# Altium schematic sheet NeoGBP_Design_Schema.schdoc
size 297 x 201 mm
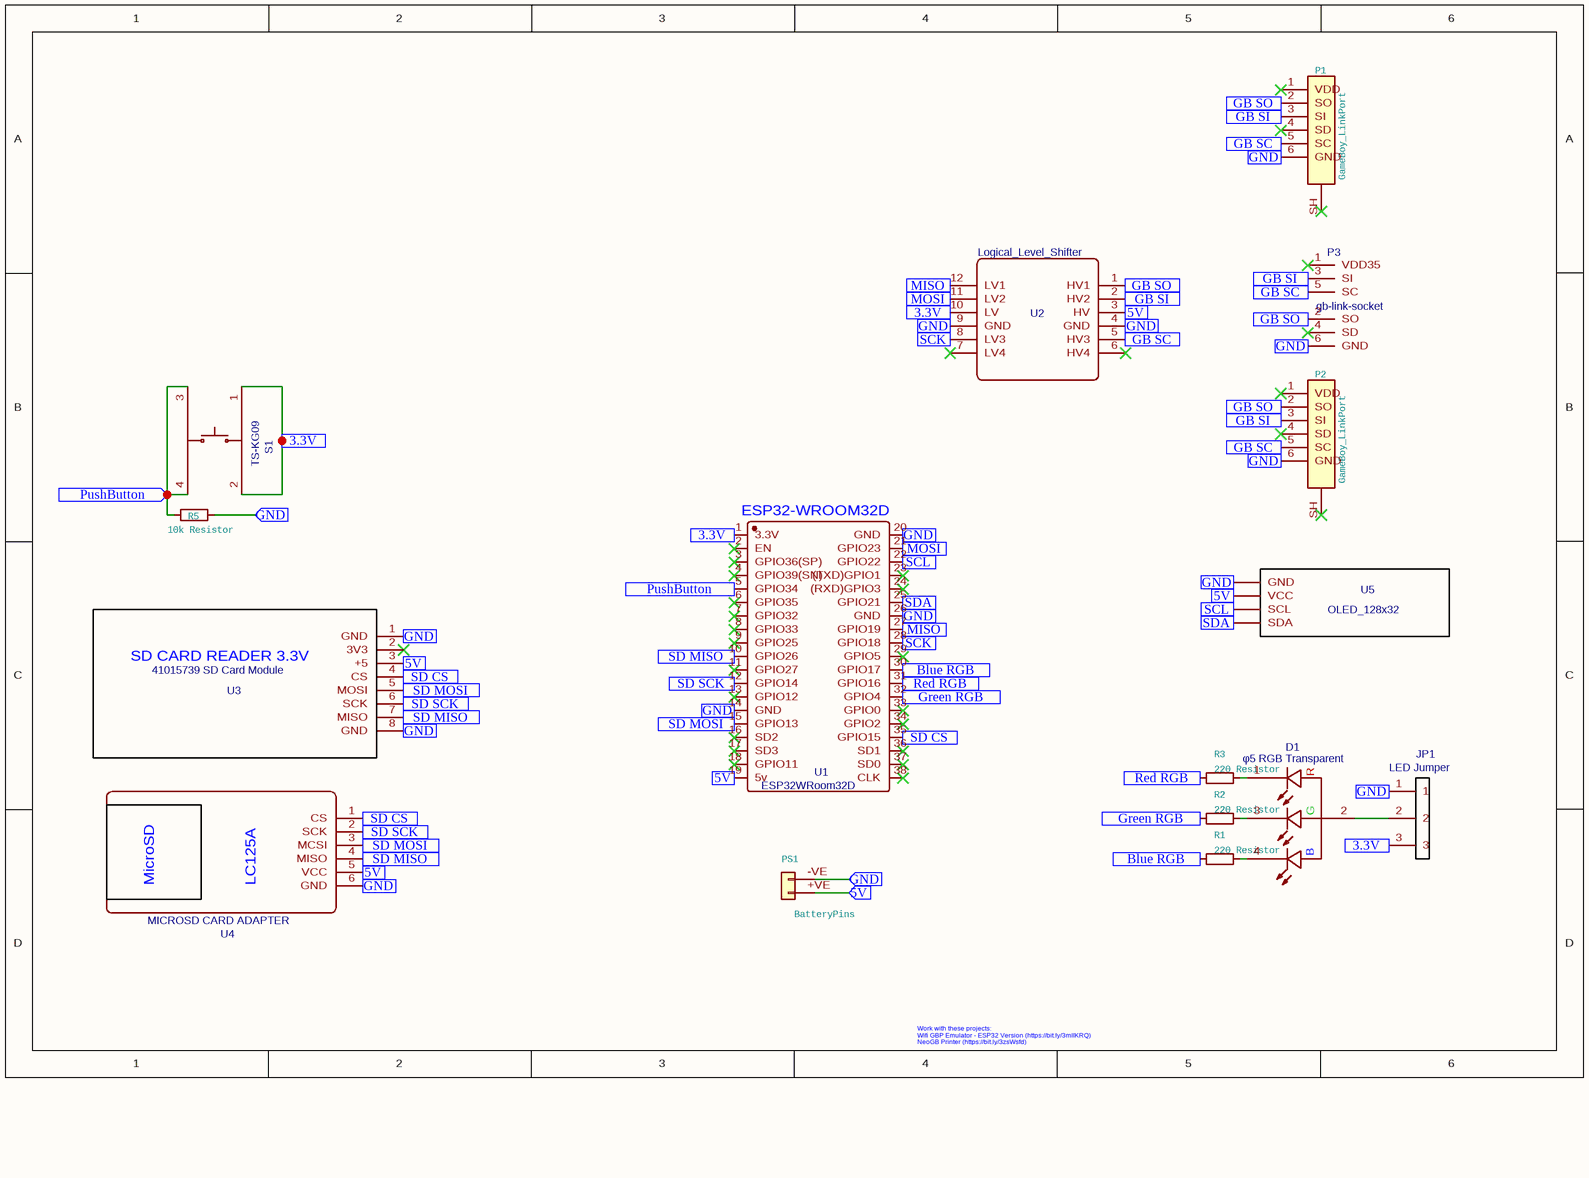
[diagram p0: NeoGBP_Design_Schema.schdoc]

## Parts
D1  φ5 RGB Transparent  [LED-TH_4P-BD5.8-P1.30]
JP1  LED Jumper  [JUMPERPAD_3]
P1  GameBoy_LinkPort  [GAMEBOY_LINKPORT_DMG_HORIZONTAL]
P2  GameBoy_LinkPort  [GAMEBOY_LINKPORT_MGB_HORIZONTAL]
P3  gb-link-socket  [GB-LINK-SOCKET]
PS1  BatteryPins  [BATTERYPAD]
R1  220 Resistor  [R_AXIAL_DIN0207_L6.3MM_D2.5MM_P10.16MM_HORIZONTAL]
R2  220 Resistor  [R_AXIAL_DIN0207_L6.3MM_D2.5MM_P10.16MM_HORIZONTAL]
R3  220 Resistor  [R_AXIAL_DIN0207_L6.3MM_D2.5MM_P10.16MM_HORIZONTAL]
R5  10k Resistor  [R_AXIAL_DIN0207_L6.3MM_D2.5MM_P10.16MM_HORIZONTAL]
S1  TS-KG09  [SW-TH_4P-L4.5-W4.5-P3.00-LS5.5]
U1  ESP32WRoom32D  [ESP32WROOM32D_SIMPLE]
U2  Logical_Level_Shifter  [LOGIC_LEVEL BIDIRECTIONAL]
U3  41015739 SD Card Module  [SD_CARD_MODULE_W/_SD_CARD_MODIFIED]
U4  MICROSD CARD ADAPTER  [ANGELELIC MICROSD CARD MODULE]
U5  OLED_128x32  [OLED-128X32]

## Ports
3.3V (in), 5V (in), Blue RGB (in), GB SC (in), GB SI (in), GB SO (in), GND (in), Green RGB (in), MISO (in), MOSI (in), PushButton (in), Red RGB (in), SCK (in), SCL (in), SD CS (in), SD MISO (in), SD MOSI (in), SD SCK (in), SDA (in)

## Nets
3.3V: JP1.3 S1.1 S1.2 U1.1(3.3V) U2.10(LV) ; port 3.3V
5V: PS1.+VE(Pin_2) U1.19(5v) U2.3(HV) U3.3(+5) U4.5(VCC) U5.3(VCC) ; port 5V
Blue RGB: R1.1 U1.30(GPIO17) ; port Blue RGB
GB SC: P1.5(SC) P2.5(SC) P3.5(SC) U2.5(HV3) ; port GB SC
GB SI: P1.3(SI) P2.3(SI) P3.3(SI) U2.2(HV2) ; port GB SI
GB SO: P1.2(SO) P2.2(SO) P3.2(SO) U2.1(HV1) ; port GB SO
GND: JP1.1 P1.6(GND) P2.6(GND) P3.6(GND) PS1.-VE(Pin_1) R5.1 U1.14(GND) U1.20(GND) U1.26(GND) U2.4(GND) U2.9(GND) U3.1(GND) U3.8(GND) U4.6(GND) U5.4(GND) ; port GND
Green RGB: R2.1 U1.32(GPIO4) ; port Green RGB
MISO: U1.27(GPIO19) U2.12(LV1) ; port MISO
MOSI: U1.21(GPIO23) U2.11(LV2) ; port MOSI
PushButton: R5.2 S1.3 S1.4 U1.5(GPIO34) ; port PushButton
Red RGB: R3.1 U1.31(GPIO16) ; port Red RGB
SCK: U1.28(GPIO18) U2.8(LV3) ; port SCK
SCL: U1.22(GPIO22) U5.2(SCL) ; port SCL
SD CS: U1.35(GPIO15) U3.4(CS) U4.1(CS) ; port SD CS
SD MISO: U1.10(GPIO26) U3.7(MISO) U4.4(MISO) ; port SD MISO
SD MOSI: U1.15(GPIO13) U3.5(MOSI) U4.3(MCSI) ; port SD MOSI
SD SCK: U1.12(GPIO14) U3.6(SCK) U4.2(SCK) ; port SD SCK
SDA: U1.25(GPIO21) U5.1(SDA) ; port SDA
NetD1_1: D1.1(KR) R3.2
NetD1_2: D1.2(CA) JP1.2
NetD1_3: D1.3(KG) R2.2
NetD1_4: D1.4(KB) R1.2

Not connected (* = marked no-connect by the designer): P1 1(VDD)* 4(SD)* SH*; P2 1(VDD)* 4(SD)* SH*; P3 1(VDD35)* 4(SD)*; U1 2(EN)* 3(GPIO36(SP))* 4(GPIO39(SN))* 6(GPIO35)* 7(GPIO32)* 8(GPIO33)* 9(GPIO25)* 11(GPIO27)* 13(GPIO12)* 16(SD2)* 17(SD3)* 18(GPIO11)* 23((TXD)GPIO1)* 24((RXD)GPIO3)* 29(GPIO5)* 33(GPIO0)* 34(GPIO2)* 36(SD1)* 37(SD0)* 38(CLK)*; U2 6(HV4)* 7(LV4)*; U3 2(3V3)*

## Notes on the sheet
- Work with these projects:
  Wifi GBP Emulator - ESP32 Version (https://bit.ly/3mIIKRQ)
  NeoGB Printer (https://bit.ly/3zsWsfd)
- (in symbol 41015739 SD Card Module) SD CARD READER 3.3V
- (in symbol ESP32WRoom32D) ESP32-WROOM32D
- (in symbol MICROSD CARD ADAPTER) MicroSD; LC125A
- (in symbol φ5 RGB Transparent) R; G; B

## Library data of the parts
D1 = φ5 RGB Transparent: BOM_Manufacturer: KENTO; BOM_Manufacturer Part: φ5 RGB Transparent LED; Contributor: LCSC; BOM_Supplier: LCSC; BOM_Supplier Part: C32985; spicePre: L; spiceSymbolName: φ5 RGB Transparent
JP1 = LED Jumper: Contributor: OFKLZ; spicePre: J; spiceSymbolName: Jumperpad_3
P3 = gb-link-socket: Contributor: zenaro147; spicePre: G; spiceSymbolName: gb-link-socket
S1 = TS-KG09: BOM_Manufacturer: Hanbo Electronic; Contributor: LCSC; BOM_Supplier: LCSC; BOM_Supplier Part: C410370; BOM_Manufacturer Part: TS-KG09; BOM_JLCPCB Part Class: Extended Part; spicePre: S; spiceSymbolName: TS-KG09
U1 = ESP32WRoom32D: BOM_Manufacturer Part: ESp32 38pin; nameAlias: Model; catid: 20; Contributor: stiv01081991; sim: true; spicePre: X; spiceSymbolName: ESP32WRoom32D
U2 = Logical_Level_Shifter: sourceId: ldJDwO6oi; Contributor: rdenning; timeStamp: 1462366452; spicePre: L; spiceSymbolName: Logical_Level_Shifter_Bidirectional
U3 = 41015739 SD Card Module: BOM_Manufacturer Part: SD card reader IL; Contributor: jamieengel03; spicePre: U; spiceSymbolName: 41015739 SD Card Module
U4 = MICROSD CARD ADAPTER: sourceId: uGz5nhzf9; timeStamp: 1462937207; BOM_Supplier Part: 9453; BOM_Supplier: SparkFun; spicePre: P; spiceSymbolName: MICROSD CARD ADAPTER
U5 = OLED_128x32: BOM_Manufacturer Part: OLED 128x32; Contributor: thesolidgeek; spicePre: U; spiceSymbolName: OLED_128x32